# EAGLE schematic testeri V1.1 (EAGLE 9.6.2)

## Sheet 1 of 2
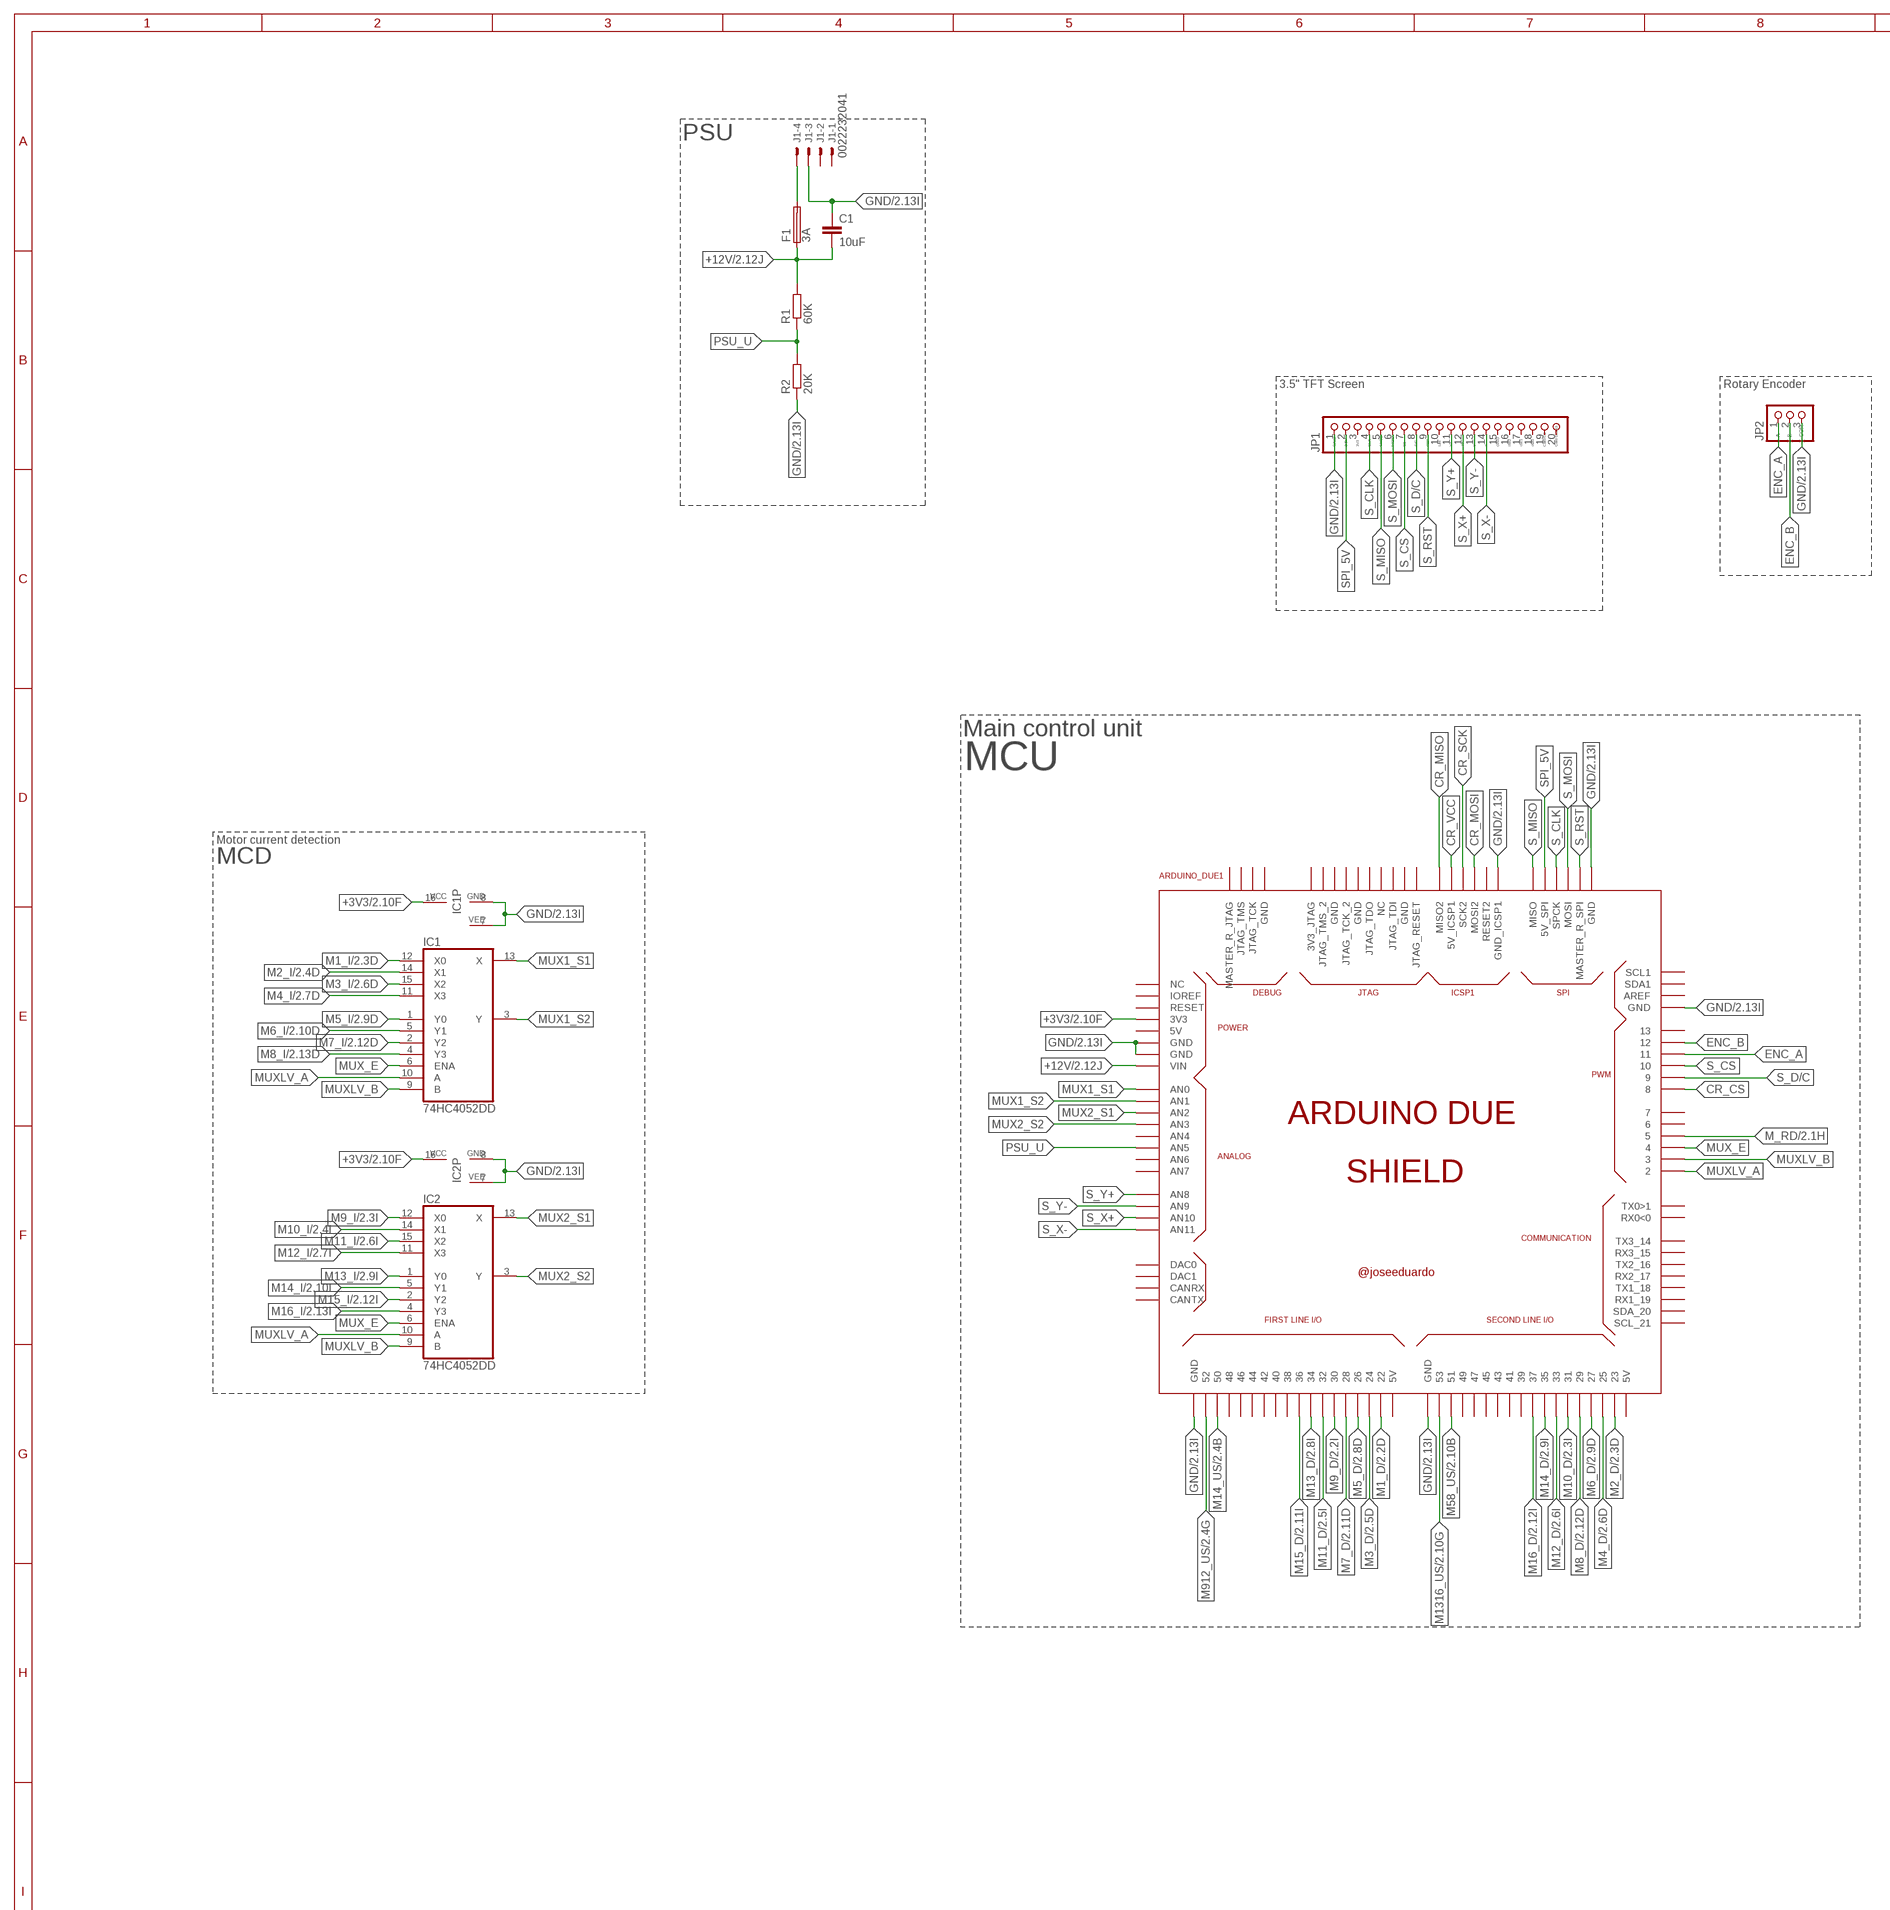
[diagram p0: schematic, sheet 1, part 1 of 2]
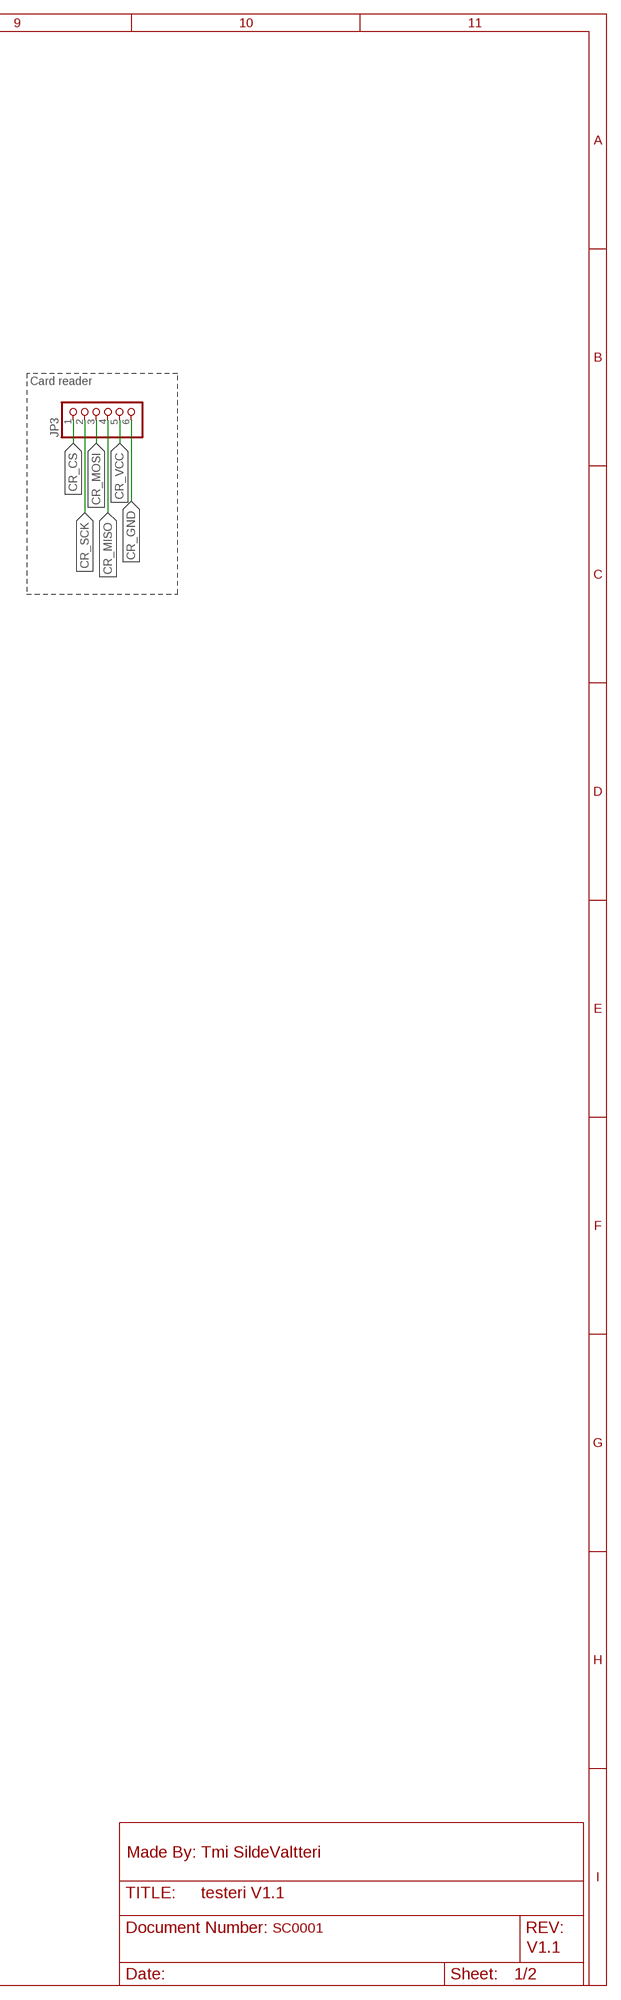
[diagram p1: schematic, sheet 1, part 2 of 2]

### Parts
ARDUINO_DUE1  ARDUINO_DUE_SHIELD  [ARDUINO_DUE_SHIELD]
C1  10uF  C-EUC3216  [C3216]
F1  3A  SH22,5  [SH22,5]
IC1  74HC4052DD  [SO16]
IC2  74HC4052DD  [SO16]
J1  0022232041  22-27-2041-04  [6410-04]
JP1  PINHD-1X20  [1X20]
JP2  PINHD-1X3  [1X03]
JP3  PINHD-1X6  [1X06]
R1  60K  R-EU_R3216W  [R3216W]
R2  20K  R-EU_R3216W  [R3216W]

### Nets
+3V3: ARDUINO_DUE1.3V3 IC1.16(VCC) IC2.16(VCC) ; also sheet 2
+12V: ARDUINO_DUE1.VIN C1.2 F1.1 R1.2 ; also sheet 2
CR_CS: ARDUINO_DUE1.8 JP3.1
CR_GND: JP3.6
CR_MISO: ARDUINO_DUE1.MISO2 JP3.4
CR_MOSI: ARDUINO_DUE1.MOSI2 JP3.3
CR_SCK: ARDUINO_DUE1.SCK2 JP3.2
CR_VCC: ARDUINO_DUE1.5V_ICSP1 JP3.5
ENC_A: ARDUINO_DUE1.11 JP2.1
ENC_B: ARDUINO_DUE1.12 JP2.2
GND: ARDUINO_DUE1.GND ARDUINO_DUE1.GND_1(GND) ARDUINO_DUE1.GND_2(GND) ARDUINO_DUE1.GND_3(GND) ARDUINO_DUE1.GND_4(GND) ARDUINO_DUE1.GND_5(GND) ARDUINO_DUE1.GND_ICSP1 C1.1 IC1.7(VEE) IC1.8(GND) IC2.7(VEE) IC2.8(GND) J1.3 JP1.1 JP2.3 R2.1 ; also sheet 2
M1_D: ARDUINO_DUE1.22 ; also sheet 2
M1_I: IC1.12(X0) ; also sheet 2
M2_D: ARDUINO_DUE1.23 ; also sheet 2
M2_I: IC1.14(X1) ; also sheet 2
M3_D: ARDUINO_DUE1.24 ; also sheet 2
M3_I: IC1.15(X2) ; also sheet 2
M4_D: ARDUINO_DUE1.25 ; also sheet 2
M4_I: IC1.11(X3) ; also sheet 2
M5_D: ARDUINO_DUE1.26 ; also sheet 2
M5_I: IC1.1(Y0) ; also sheet 2
M6_D: ARDUINO_DUE1.27 ; also sheet 2
M6_I: IC1.5(Y1) ; also sheet 2
M7_D: ARDUINO_DUE1.28 ; also sheet 2
M7_I: IC1.2(Y2) ; also sheet 2
M8_D: ARDUINO_DUE1.29 ; also sheet 2
M8_I: IC1.4(Y3) ; also sheet 2
M9_D: ARDUINO_DUE1.30 ; also sheet 2
M9_I: IC2.12(X0) ; also sheet 2
M10_D: ARDUINO_DUE1.31 ; also sheet 2
M10_I: IC2.14(X1) ; also sheet 2
M11_D: ARDUINO_DUE1.32 ; also sheet 2
M11_I: IC2.15(X2) ; also sheet 2
M12_D: ARDUINO_DUE1.33 ; also sheet 2
M12_I: IC2.11(X3) ; also sheet 2
M13_D: ARDUINO_DUE1.34 ; also sheet 2
M13_I: IC2.1(Y0) ; also sheet 2
M14_D: ARDUINO_DUE1.35 ; also sheet 2
M14_I: IC2.5(Y1) ; also sheet 2
M14_US: ARDUINO_DUE1.50 ; also sheet 2
M15_D: ARDUINO_DUE1.36 ; also sheet 2
M15_I: IC2.2(Y2) ; also sheet 2
M16_D: ARDUINO_DUE1.37 ; also sheet 2
M16_I: IC2.4(Y3) ; also sheet 2
M58_US: ARDUINO_DUE1.51 ; also sheet 2
M912_US: ARDUINO_DUE1.52 ; also sheet 2
M1316_US: ARDUINO_DUE1.53 ; also sheet 2
M_RD: ARDUINO_DUE1.5 ; also sheet 2
MUX1_S1: ARDUINO_DUE1.A0(AN0) IC1.13(X)
MUX1_S2: ARDUINO_DUE1.A1(AN1) IC1.3(Y)
MUX2_S1: ARDUINO_DUE1.A2(AN2) IC2.13(X)
MUX2_S2: ARDUINO_DUE1.A3(AN3) IC2.3(Y)
MUX_E: ARDUINO_DUE1.4 IC1.6(ENA) IC2.6(ENA)
MUXLV_A: ARDUINO_DUE1.2 IC1.10(A) IC2.10(A)
MUXLV_B: ARDUINO_DUE1.3 IC1.9(B) IC2.9(B)
N$1: F1.2 J1.4
PSU_U: ARDUINO_DUE1.A5(AN5) R1.1 R2.2
S_CLK: ARDUINO_DUE1.SPCK JP1.4
S_CS: ARDUINO_DUE1.10 JP1.7
S_D/C: ARDUINO_DUE1.9 JP1.8
S_MISO: ARDUINO_DUE1.MISO JP1.5
S_MOSI: ARDUINO_DUE1.MOSI JP1.6
S_RST: ARDUINO_DUE1.MASTER_RESET_SPI(MASTER_R_SPI) JP1.9
S_X+: ARDUINO_DUE1.A10(AN10) JP1.12
S_X-: ARDUINO_DUE1.A11(AN11) JP1.14
S_Y+: ARDUINO_DUE1.A8(AN8) JP1.11
S_Y-: ARDUINO_DUE1.A9(AN9) JP1.13
SPI_5V: ARDUINO_DUE1.5V_2(5V_SPI) JP1.2
Unconnected: ARDUINO_DUE1.0(RX0<0) ARDUINO_DUE1.1(TX0>1) ARDUINO_DUE1.3V3_JTAG ARDUINO_DUE1.5V0(5V) ARDUINO_DUE1.5V0_1(5V) ARDUINO_DUE1.5V0_2(5V) ARDUINO_DUE1.6 ARDUINO_DUE1.7 ARDUINO_DUE1.13 ARDUINO_DUE1.14(TX3_14) ARDUINO_DUE1.15(RX3_15) ARDUINO_DUE1.16(TX2_16) ARDUINO_DUE1.17(RX2_17) ARDUINO_DUE1.18(TX1_18) ARDUINO_DUE1.19(RX1_19) ARDUINO_DUE1.20(SDA_20) ARDUINO_DUE1.21(SCL_21) ARDUINO_DUE1.38 ARDUINO_DUE1.39 ARDUINO_DUE1.40 ARDUINO_DUE1.41 ARDUINO_DUE1.42 ARDUINO_DUE1.43 ARDUINO_DUE1.44 ARDUINO_DUE1.45 ARDUINO_DUE1.46 ARDUINO_DUE1.47 ARDUINO_DUE1.48 ARDUINO_DUE1.49 ARDUINO_DUE1.A4(AN4) ARDUINO_DUE1.A6(AN6) ARDUINO_DUE1.A7(AN7) ARDUINO_DUE1.AREF ARDUINO_DUE1.CANRX ARDUINO_DUE1.CANTX ARDUINO_DUE1.DAC0 ARDUINO_DUE1.DAC1 ARDUINO_DUE1.GND_7(GND) ARDUINO_DUE1.GND_8(GND) ARDUINO_DUE1.GND_9(GND) ARDUINO_DUE1.GND_10(GND) ARDUINO_DUE1.IOREF ARDUINO_DUE1.JTAG_RESET ARDUINO_DUE1.JTAG_TCK ARDUINO_DUE1.JTAG_TCK_2 ARDUINO_DUE1.JTAG_TDI ARDUINO_DUE1.JTAG_TDO ARDUINO_DUE1.JTAG_TMS ARDUINO_DUE1.JTAG_TMS_2 ARDUINO_DUE1.MASTER_RESET_JTAG(MASTER_R_JTAG) ARDUINO_DUE1.NC_2(NC) ARDUINO_DUE1.NC_5(NC) ARDUINO_DUE1.RESET ARDUINO_DUE1.RESET2 ARDUINO_DUE1.SCL1 ARDUINO_DUE1.SDA1 J1.1 J1.2 JP1.3 JP1.10 JP1.15 JP1.16 JP1.17 JP1.18 JP1.19 JP1.20

### Notes on the sheet
- PSU
- 3.5" TFT Screen | Rotary Encoder | Card reader
- A | B | COM
- Main control unit
- MCU
- Motor current detection
- MCD
- Made By: Tmi SildeValtteri
- SC0001
- V1.1

## Sheet 2 of 2
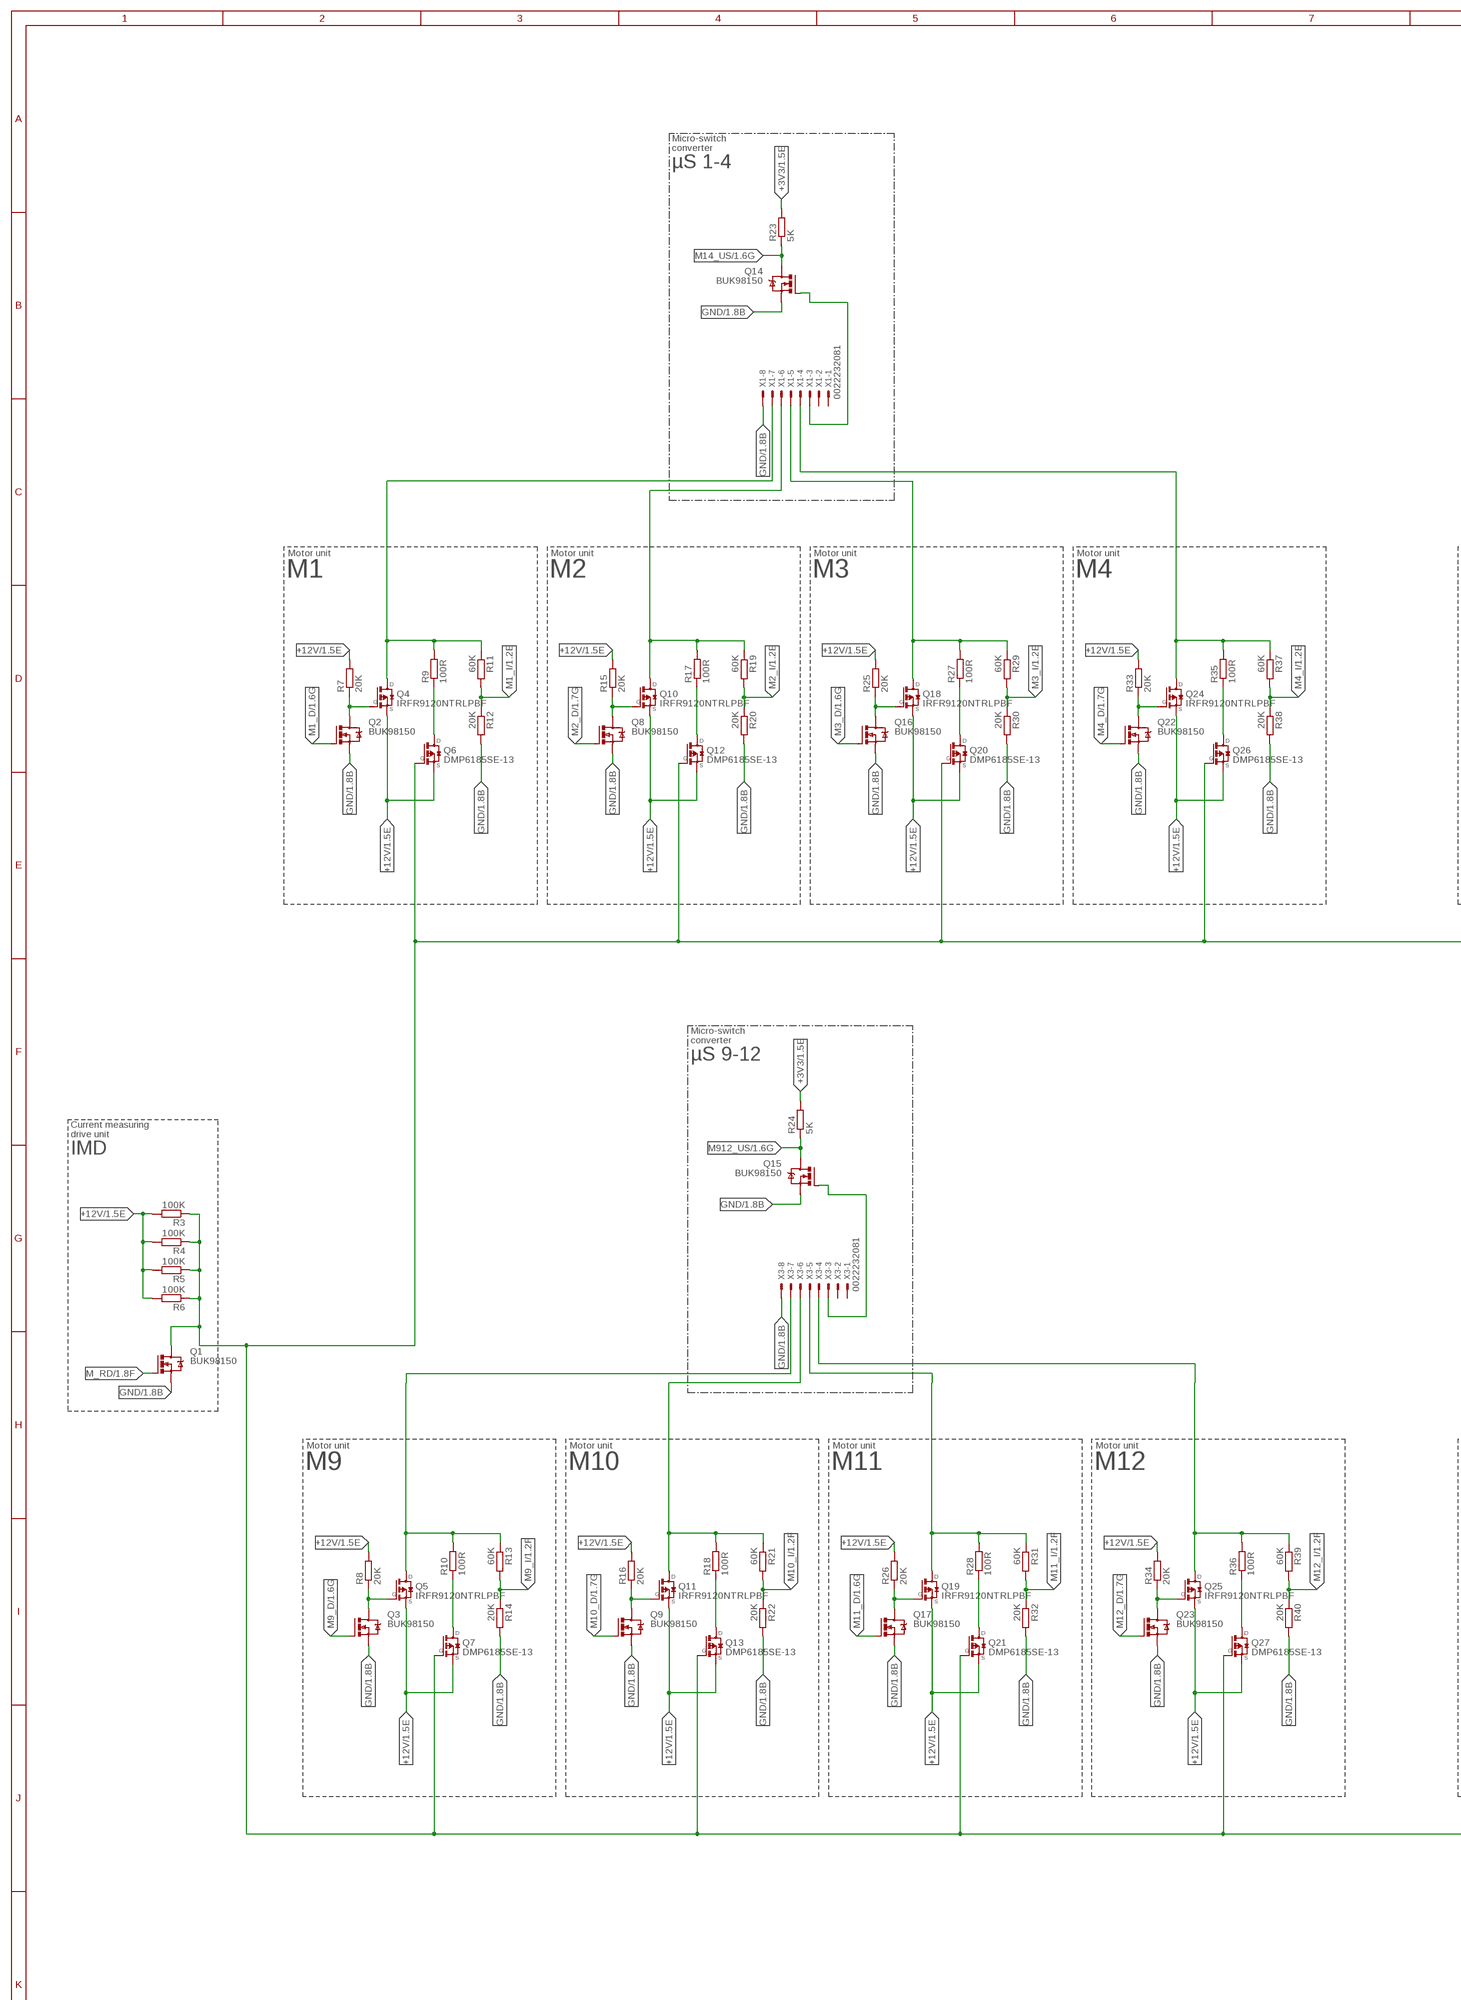
[diagram p2: schematic, sheet 2, part 1 of 3]
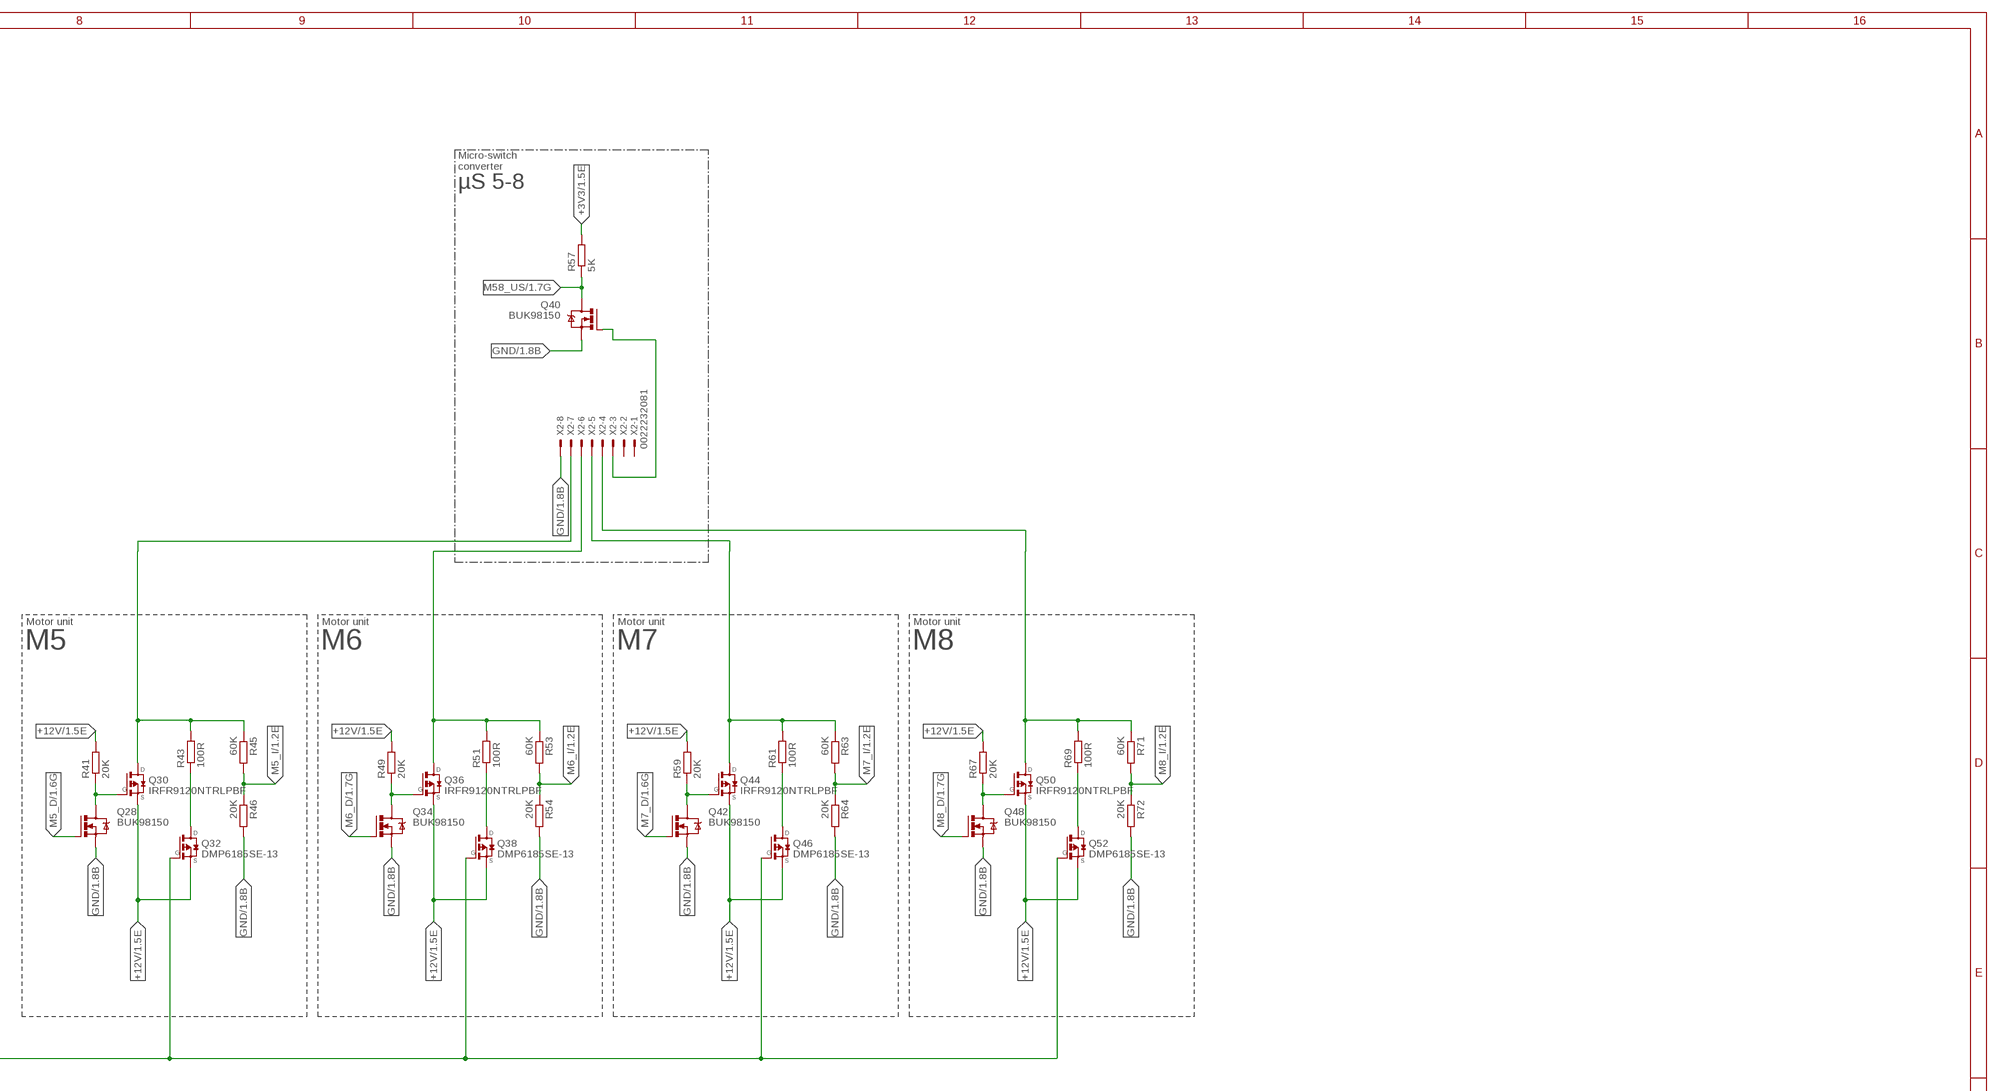
[diagram p3: schematic, sheet 2, part 2 of 3]
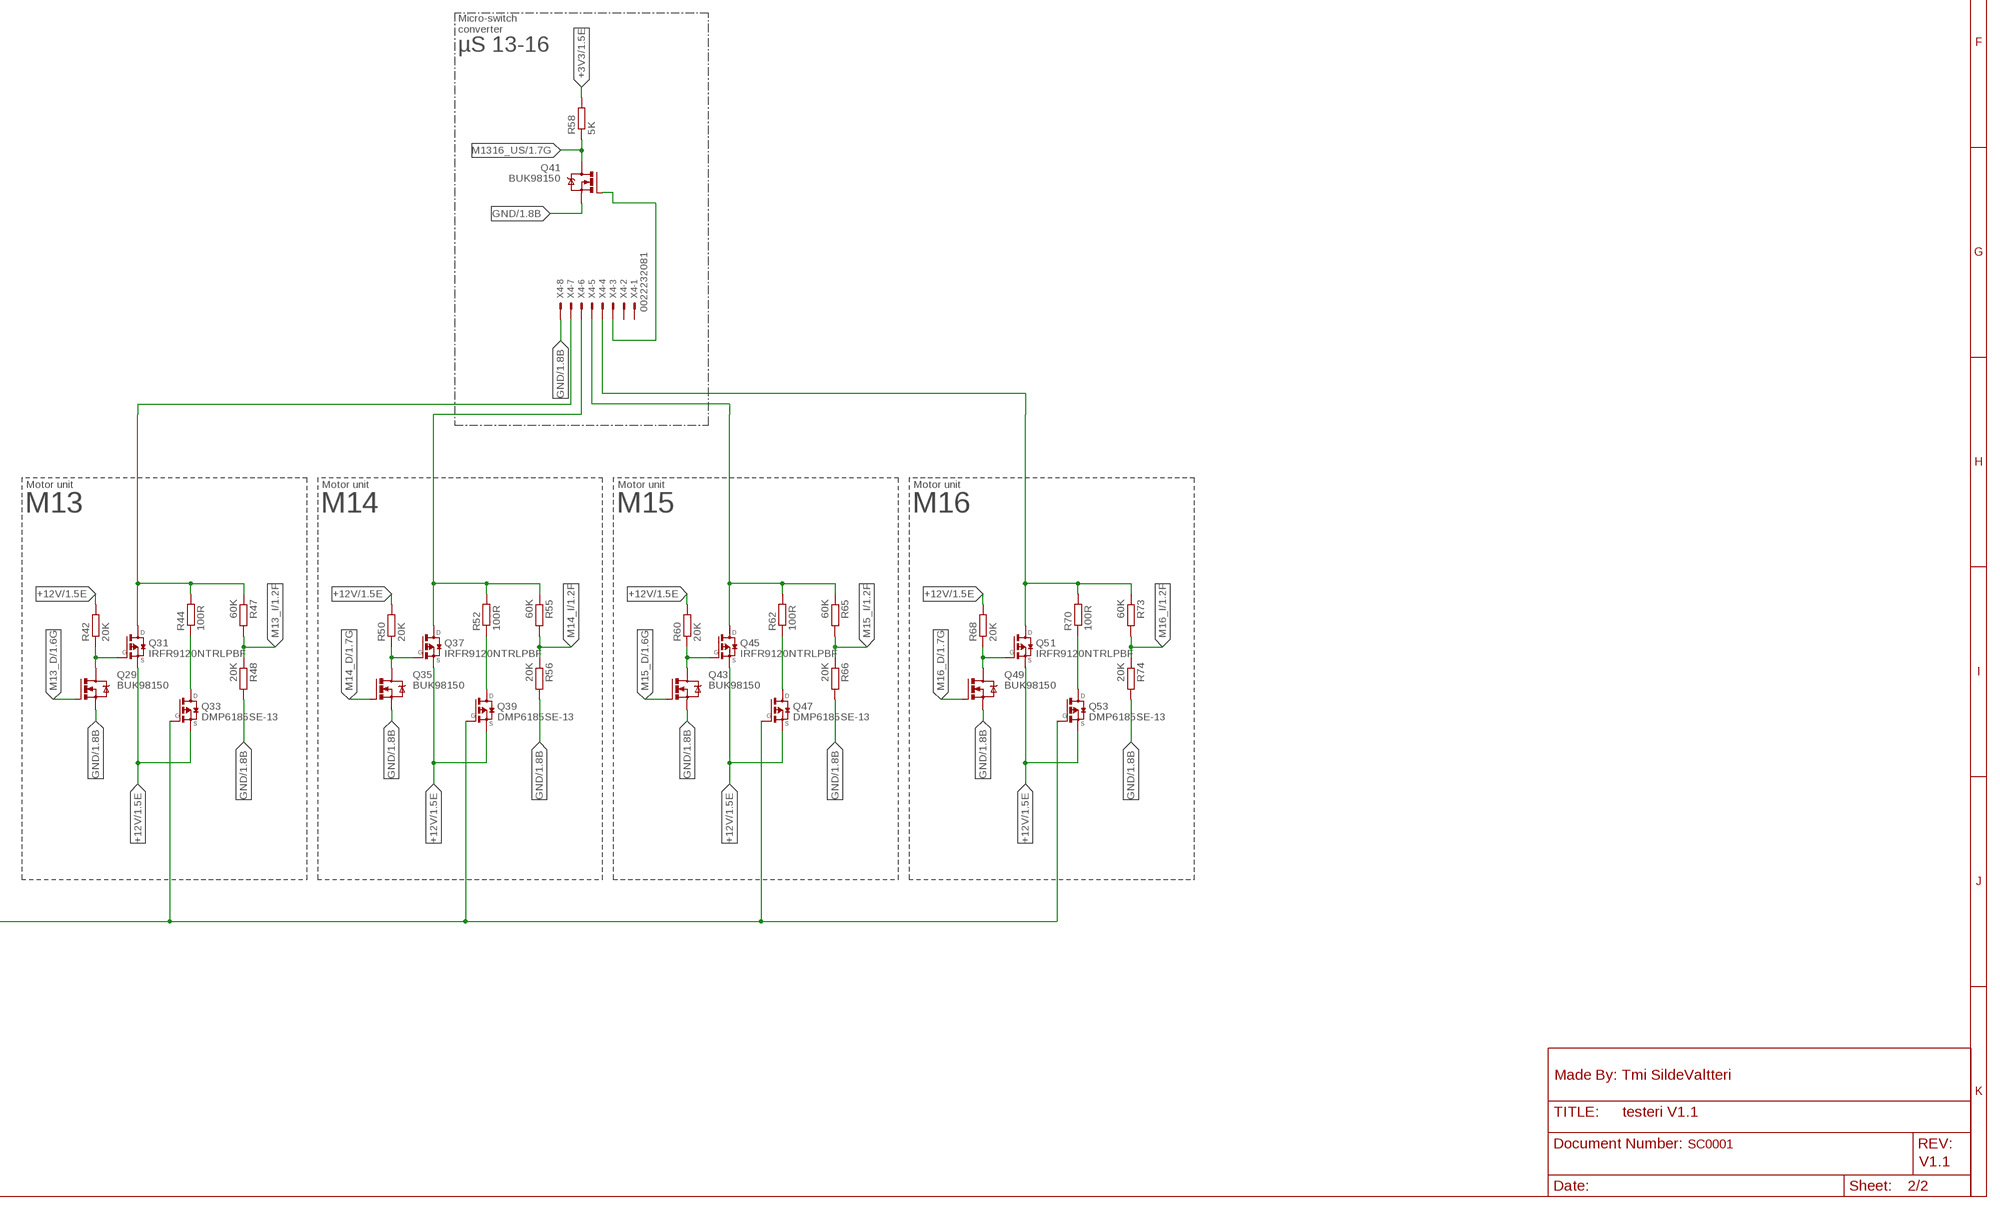
[diagram p4: schematic, sheet 2, part 3 of 3]

### Parts
Q1  BUK98150  [SOT223]
Q2  BUK98150  [SOT223]
Q3  BUK98150  [SOT223]
Q4  IRFR9120NTRLPBF  [D-PAK_TO252AA]
Q5  IRFR9120NTRLPBF  [D-PAK_TO252AA]
Q6  DMP6185SE-13  [SOT223]
Q7  DMP6185SE-13  [SOT223]
Q8  BUK98150  [SOT223]
Q9  BUK98150  [SOT223]
Q10  IRFR9120NTRLPBF  [D-PAK_TO252AA]
Q11  IRFR9120NTRLPBF  [D-PAK_TO252AA]
Q12  DMP6185SE-13  [SOT223]
Q13  DMP6185SE-13  [SOT223]
Q14  BUK98150  [SOT223]
Q15  BUK98150  [SOT223]
Q16  BUK98150  [SOT223]
Q17  BUK98150  [SOT223]
Q18  IRFR9120NTRLPBF  [D-PAK_TO252AA]
Q19  IRFR9120NTRLPBF  [D-PAK_TO252AA]
Q20  DMP6185SE-13  [SOT223]
Q21  DMP6185SE-13  [SOT223]
Q22  BUK98150  [SOT223]
Q23  BUK98150  [SOT223]
Q24  IRFR9120NTRLPBF  [D-PAK_TO252AA]
Q25  IRFR9120NTRLPBF  [D-PAK_TO252AA]
Q26  DMP6185SE-13  [SOT223]
Q27  DMP6185SE-13  [SOT223]
Q28  BUK98150  [SOT223]
Q29  BUK98150  [SOT223]
Q30  IRFR9120NTRLPBF  [D-PAK_TO252AA]
Q31  IRFR9120NTRLPBF  [D-PAK_TO252AA]
Q32  DMP6185SE-13  [SOT223]
Q33  DMP6185SE-13  [SOT223]
Q34  BUK98150  [SOT223]
Q35  BUK98150  [SOT223]
Q36  IRFR9120NTRLPBF  [D-PAK_TO252AA]
Q37  IRFR9120NTRLPBF  [D-PAK_TO252AA]
Q38  DMP6185SE-13  [SOT223]
Q39  DMP6185SE-13  [SOT223]
Q40  BUK98150  [SOT223]
Q41  BUK98150  [SOT223]
Q42  BUK98150  [SOT223]
Q43  BUK98150  [SOT223]
Q44  IRFR9120NTRLPBF  [D-PAK_TO252AA]
Q45  IRFR9120NTRLPBF  [D-PAK_TO252AA]
Q46  DMP6185SE-13  [SOT223]
Q47  DMP6185SE-13  [SOT223]
Q48  BUK98150  [SOT223]
Q49  BUK98150  [SOT223]
Q50  IRFR9120NTRLPBF  [D-PAK_TO252AA]
Q51  IRFR9120NTRLPBF  [D-PAK_TO252AA]
Q52  DMP6185SE-13  [SOT223]
Q53  DMP6185SE-13  [SOT223]
R3  100K  R-EU_R3216W  [R3216W]
R4  100K  R-EU_R3216W  [R3216W]
R5  100K  R-EU_R3216W  [R3216W]
R6  100K  R-EU_R3216W  [R3216W]
R7  20K  R-EU_R3216W  [R3216W]
R8  20K  R-EU_R3216W  [R3216W]
R9  100R  R-EU_0411/15  [0411/15]
R10  100R  R-EU_0411/15  [0411/15]
R11  60K  R-EU_R3216W  [R3216W]
R12  20K  R-EU_R3216W  [R3216W]
R13  60K  R-EU_R3216W  [R3216W]
R14  20K  R-EU_R3216W  [R3216W]
R15  20K  R-EU_R3216W  [R3216W]
R16  20K  R-EU_R3216W  [R3216W]
R17  100R  R-EU_0411/15  [0411/15]
R18  100R  R-EU_0411/15  [0411/15]
R19  60K  R-EU_R3216W  [R3216W]
R20  20K  R-EU_R3216W  [R3216W]
R21  60K  R-EU_R3216W  [R3216W]
R22  20K  R-EU_R3216W  [R3216W]
R23  5K  R-EU_R3216W  [R3216W]
R24  5K  R-EU_R3216W  [R3216W]
R25  20K  R-EU_R3216W  [R3216W]
R26  20K  R-EU_R3216W  [R3216W]
R27  100R  R-EU_0411/15  [0411/15]
R28  100R  R-EU_0411/15  [0411/15]
R29  60K  R-EU_R3216W  [R3216W]
R30  20K  R-EU_R3216W  [R3216W]
R31  60K  R-EU_R3216W  [R3216W]
R32  20K  R-EU_R3216W  [R3216W]
R33  20K  R-EU_R3216W  [R3216W]
R34  20K  R-EU_R3216W  [R3216W]
R35  100R  R-EU_0411/15  [0411/15]
R36  100R  R-EU_0411/15  [0411/15]
R37  60K  R-EU_R3216W  [R3216W]
R38  20K  R-EU_R3216W  [R3216W]
R39  60K  R-EU_R3216W  [R3216W]
R40  20K  R-EU_R3216W  [R3216W]
R41  20K  R-EU_R3216W  [R3216W]
R42  20K  R-EU_R3216W  [R3216W]
R43  100R  R-EU_0411/15  [0411/15]
R44  100R  R-EU_0411/15  [0411/15]
R45  60K  R-EU_R3216W  [R3216W]
R46  20K  R-EU_R3216W  [R3216W]
R47  60K  R-EU_R3216W  [R3216W]
R48  20K  R-EU_R3216W  [R3216W]
R49  20K  R-EU_R3216W  [R3216W]
R50  20K  R-EU_R3216W  [R3216W]
R51  100R  R-EU_0411/15  [0411/15]
R52  100R  R-EU_0411/15  [0411/15]
R53  60K  R-EU_R3216W  [R3216W]
R54  20K  R-EU_R3216W  [R3216W]
R55  60K  R-EU_R3216W  [R3216W]
R56  20K  R-EU_R3216W  [R3216W]
R57  5K  R-EU_R3216W  [R3216W]
R58  5K  R-EU_R3216W  [R3216W]
R59  20K  R-EU_R3216W  [R3216W]
R60  20K  R-EU_R3216W  [R3216W]
R61  100R  R-EU_0411/15  [0411/15]
R62  100R  R-EU_0411/15  [0411/15]
R63  60K  R-EU_R3216W  [R3216W]
R64  20K  R-EU_R3216W  [R3216W]
R65  60K  R-EU_R3216W  [R3216W]
R66  20K  R-EU_R3216W  [R3216W]
R67  20K  R-EU_R3216W  [R3216W]
R68  20K  R-EU_R3216W  [R3216W]
R69  100R  R-EU_0411/15  [0411/15]
R70  100R  R-EU_0411/15  [0411/15]
R71  60K  R-EU_R3216W  [R3216W]
R72  20K  R-EU_R3216W  [R3216W]
R73  60K  R-EU_R3216W  [R3216W]
R74  20K  R-EU_R3216W  [R3216W]
X1  0022232081  22-23-2081  [22-23-2081]
X2  0022232081  22-23-2081  [22-23-2081]
X3  0022232081  22-23-2081  [22-23-2081]
X4  0022232081  22-23-2081  [22-23-2081]

### Nets
+3V3: R23.2 R24.2 R57.2 R58.2 ; also sheet 1
+12V: Q4.3(S) Q5.3(S) Q6.3(S) Q7.3(S) Q10.3(S) Q11.3(S) Q12.3(S) Q13.3(S) Q18.3(S) Q19.3(S) Q20.3(S) Q21.3(S) Q24.3(S) Q25.3(S) Q26.3(S) Q27.3(S) Q30.3(S) Q31.3(S) Q32.3(S) Q33.3(S) Q36.3(S) Q37.3(S) Q38.3(S) Q39.3(S) Q44.3(S) Q45.3(S) Q46.3(S) Q47.3(S) Q50.3(S) Q51.3(S) Q52.3(S) Q53.3(S) R3.2 R4.2 R5.2 R6.2 R7.2 R8.2 R15.2 R16.2 R25.2 R26.2 R33.2 R34.2 R41.2 R42.2 R49.2 R50.2 R59.2 R60.2 R67.2 R68.2 ; also sheet 1
GND: Q1.3(S) Q2.3(S) Q3.3(S) Q8.3(S) Q9.3(S) Q14.3(S) Q15.3(S) Q16.3(S) Q17.3(S) Q22.3(S) Q23.3(S) Q28.3(S) Q29.3(S) Q34.3(S) Q35.3(S) Q40.3(S) Q41.3(S) Q42.3(S) Q43.3(S) Q48.3(S) Q49.3(S) R12.2 R14.2 R20.2 R22.2 R30.2 R32.2 R38.2 R40.2 R46.2 R48.2 R54.2 R56.2 R64.2 R66.2 R72.2 R74.2 X1.8 X2.8 X3.8 X4.8 ; also sheet 1
M1_D: Q2.1(G) ; also sheet 1
M1_I: R11.2 R12.1 ; also sheet 1
M2_D: Q8.1(G) ; also sheet 1
M2_I: R19.2 R20.1 ; also sheet 1
M3_D: Q16.1(G) ; also sheet 1
M3_I: R29.2 R30.1 ; also sheet 1
M4_D: Q22.1(G) ; also sheet 1
M4_I: R37.2 R38.1 ; also sheet 1
M5_D: Q28.1(G) ; also sheet 1
M5_I: R45.2 R46.1 ; also sheet 1
M6_D: Q34.1(G) ; also sheet 1
M6_I: R53.2 R54.1 ; also sheet 1
M7_D: Q42.1(G) ; also sheet 1
M7_I: R63.2 R64.1 ; also sheet 1
M8_D: Q48.1(G) ; also sheet 1
M8_I: R71.2 R72.1 ; also sheet 1
M9_D: Q3.1(G) ; also sheet 1
M9_I: R13.2 R14.1 ; also sheet 1
M10_D: Q9.1(G) ; also sheet 1
M10_I: R21.2 R22.1 ; also sheet 1
M11_D: Q17.1(G) ; also sheet 1
M11_I: R31.2 R32.1 ; also sheet 1
M12_D: Q23.1(G) ; also sheet 1
M12_I: R39.2 R40.1 ; also sheet 1
M13_D: Q29.1(G) ; also sheet 1
M13_I: R47.2 R48.1 ; also sheet 1
M14_D: Q35.1(G) ; also sheet 1
M14_I: R55.2 R56.1 ; also sheet 1
M14_US: Q14.2(D) Q14.4(D) R23.1 ; also sheet 1
M15_D: Q43.1(G) ; also sheet 1
M15_I: R65.2 R66.1 ; also sheet 1
M16_D: Q49.1(G) ; also sheet 1
M16_I: R73.2 R74.1 ; also sheet 1
M58_US: Q40.2(D) Q40.4(D) R57.1 ; also sheet 1
M912_US: Q15.2(D) Q15.4(D) R24.1 ; also sheet 1
M1316_US: Q41.2(D) Q41.4(D) R58.1 ; also sheet 1
M_RD: Q1.1(G) ; also sheet 1
N$2: Q8.2(D) Q8.4(D) Q10.1(G) R15.1
N$3: Q14.1(G) X1.3
N$4: Q10.4(D) R17.2 R19.1 X1.6
N$5: Q1.2(D) Q1.4(D) Q6.1(G) Q7.1(G) Q12.1(G) Q13.1(G) Q20.1(G) Q21.1(G) Q26.1(G) Q27.1(G) Q32.1(G) Q33.1(G) Q38.1(G) Q39.1(G) Q46.1(G) Q47.1(G) Q52.1(G) Q53.1(G) R3.1 R4.1 R5.1 R6.1
N$6: Q2.2(D) Q2.4(D) Q4.1(G) R7.1
N$7: Q4.4(D) R9.2 R11.1 X1.7
N$8: Q6.2(D) Q6.4(D) R9.1
N$9: Q12.2(D) Q12.4(D) R17.1
N$10: Q40.1(G) X2.3
N$11: Q16.2(D) Q16.4(D) Q18.1(G) R25.1
N$12: Q18.4(D) R27.2 R29.1 X1.5
N$13: Q20.2(D) Q20.4(D) R27.1
N$14: Q30.4(D) R43.2 R45.1 X2.7
N$15: Q22.2(D) Q22.4(D) Q24.1(G) R33.1
N$17: Q26.2(D) Q26.4(D) R35.1
N$18: Q36.4(D) R51.2 R53.1 X2.6
N$19: Q28.2(D) Q28.4(D) Q30.1(G) R41.1
N$20: Q3.2(D) Q3.4(D) Q5.1(G) R8.1
N$21: Q32.2(D) Q32.4(D) R43.1
N$22: Q44.4(D) R61.2 R63.1 X2.5
N$23: Q34.2(D) Q34.4(D) Q36.1(G) R49.1
N$24: Q7.2(D) Q7.4(D) R10.1
N$25: Q38.2(D) Q38.4(D) R51.1
N$26: Q50.4(D) R69.2 R71.1 X2.4
N$27: Q42.2(D) Q42.4(D) Q44.1(G) R59.1
N$28: Q9.2(D) Q9.4(D) Q11.1(G) R16.1
N$29: Q46.2(D) Q46.4(D) R61.1
N$30: Q24.4(D) R35.2 R37.1 X1.4
N$31: Q48.2(D) Q48.4(D) Q50.1(G) R67.1
N$32: Q13.2(D) Q13.4(D) R18.1
N$33: Q52.2(D) Q52.4(D) R69.1
N$34: Q17.2(D) Q17.4(D) Q19.1(G) R26.1
N$35: Q21.2(D) Q21.4(D) R28.1
N$36: Q23.2(D) Q23.4(D) Q25.1(G) R34.1
N$37: Q27.2(D) Q27.4(D) R36.1
N$38: Q15.1(G) X3.3
N$39: Q5.4(D) R10.2 R13.1 X3.7
N$40: Q11.4(D) R18.2 R21.1 X3.6
N$41: Q19.4(D) R28.2 R31.1 X3.5
N$42: Q25.4(D) R36.2 R39.1 X3.4
N$44: Q29.2(D) Q29.4(D) Q31.1(G) R42.1
N$45: Q33.2(D) Q33.4(D) R44.1
N$46: Q35.2(D) Q35.4(D) Q37.1(G) R50.1
N$47: Q39.2(D) Q39.4(D) R52.1
N$48: Q43.2(D) Q43.4(D) Q45.1(G) R60.1
N$49: Q47.2(D) Q47.4(D) R62.1
N$50: Q49.2(D) Q49.4(D) Q51.1(G) R68.1
N$51: Q53.2(D) Q53.4(D) R70.1
N$52: Q41.1(G) X4.3
N$53: Q31.4(D) R44.2 R47.1 X4.7
N$54: Q37.4(D) R52.2 R55.1 X4.6
N$55: Q45.4(D) R62.2 R65.1 X4.5
N$56: Q51.4(D) R70.2 R73.1 X4.4
Unconnected: X1.1 X1.2 X2.1 X2.2 X3.1 X3.2 X4.1 X4.2

### Notes on the sheet
- Micro-switch
  converter
- Micro-switch
  converter
- µS 1-4 | µS 5-8
- Motor unit | Motor unit | Motor unit | Motor unit | Motor unit | Motor unit | Motor unit | Motor unit
- M1 | M2 | M3 | M4 | M5 | M6 | M7 | M8
- Micro-switch
  converter
- Micro-switch
  converter
- µS 9-12 | µS 13-16
- Current measuring
  drive unit
- IMD
- Motor unit | Motor unit | Motor unit | Motor unit | Motor unit | Motor unit | Motor unit | Motor unit
- M9 | M10 | M11 | M12 | M13 | M14 | M15 | M16
- Made By: Tmi SildeValtteri
- SC0001
- V1.1

## Library data of the parts
ARDUINO_DUE1 = arduino_due_shield:ARDUINO_DUE_SHIELD
C1 = rcl:C-EU: CAPACITOR, European symbol; SPICEPREFIX: C
F1 = fuse:SH22,5: FUSE HOLDER grid 22,5 mm, OGN0031 8201, Schurter (Buerklin); MF: SCHURTER; MPN: 0031.8201; OC_FARNELL: 1162740; OC_NEWARK: 96F8317
IC1 IC2 = snacktime:74HC4052D: Dual 4-channel ANALOG MULTIPLEXER snacktime Link <https://fi.farnell.com/nexperia/74hc4052d/ic-cmos-mux-demux-16soic/dp/1201328>; FARNELLNRO: 74HC4052D,653
J1 = con-molex:22-?-04: CONNECTOR wire to board 2.54 mm (.1 inch) pitch header; MF: MOLEX; OC_FARNELL: unknown; OC_NEWARK: unknown
JP1 = snacktime:PINHD-1X20: PIN HEADER
JP2 = adafruit:PINHD-1X3: PIN HEADER
JP3 = adafruit:PINHD-1X6: PIN HEADER
Q1-Q3 Q8 Q9 Q14-Q17 Q22 Q23 Q28 Q29 Q34 Q35 Q40-Q43 Q48 Q49 = snacktime:BUK98150: BUK98150-55A/CUF N-Channel MOSFET snacktime Link <https://fi.farnell.com/on-semiconductor/ndt3055/mosfet-n-smd-sot-223-full-reel/dp/2438363>; FARNELLNRO: NDT3055
Q4 Q5 Q10 Q11 Q18 Q19 Q24 Q25 Q30 Q31 Q36 Q37 Q44 Q45 Q50 Q51 = snacktime:IRFR9120NTRLPBF: IRFR9120NTRLPBF P-CHANNELL MOSFET snacktime
Q6 Q7 Q12 Q13 Q20 Q21 Q26 Q27 Q32 Q33 Q38 Q39 Q46 Q47 Q52 Q53 = snacktime:DMP6185SE-13: DMP6185SE-13 P-CHANNEL MOSFET snacktime
R1-R74 = rcl:R-EU_: RESISTOR, European symbol; SPICEPREFIX: R
X1-X4 = con-molex:22-23-2081: .100" (2.54mm) Center Header - 8 Pin; MF: MOLEX; MPN: 22-23-2081; OC_FARNELL: 1756826; OC_NEWARK: 01C7592